# EAGLE design GPS Module_2 (EAGLE 9.6.2)
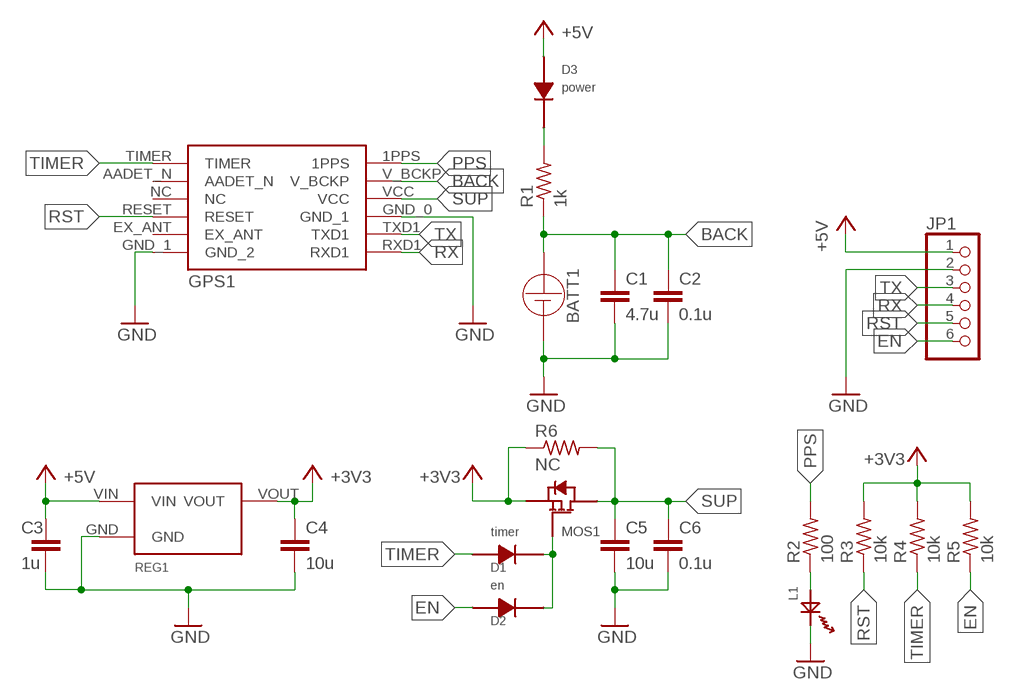
[diagram p0: schematic, sheet 1]

## Parts
BATT1  CR2032_PLATE  [CR2032_PLATE]
C1  4.7u  C-EUC0603  [C0603]
C2  0.1u  C-EUC0603  [C0603]
C3  1u  C-EUC0603  [C0603]
C4  10u  C-EUC0603  [C0603]
C5  10u  C-EUC0603  [C0603]
C6  0.1u  C-EUC0603  [C0603]
D1  timer  1W4148W  [SOD-123]
D2  en  1W4148W  [SOD-123]
D3  power  SS2040FL  [SOD-123FL]
GPS1  L80-M39  [L80]
JP1  PINHD-1X6  [1X06]
L1  OSXX1608C1A  [OSXX1608C1A]
MOS1  AO3401A  [SOT-23]
R1  1k  R-US_R0603  [R0603]
R2  100  R-US_R0603  [R0603]
R3  10k  R-US_R0603  [R0603]
R4  10k  R-US_R0603  [R0603]
R5  10k  R-US_R0603  [R0603]
R6  NC  R-US_R0603  [R0603]
REG1  AP7375  [SOT23]

## Nets
+3V3: C4.1 MOS1.S R3.2 R4.2 R5.2 R6.1 REG1.VOUT
+5V: C3.1 D3.C JP1.1 REG1.VIN
BACK: BATT1.VCC C1.1 C2.1 GPS1.V_BCKP R1.1
EN: D2.C JP1.6 R5.1
GND [gnd]: BATT1.GND C1.2 C2.2 C3.2 C4.2 C5.2 C6.2 GPS1.GND_0(GND_1) GPS1.GND_1(GND_2) JP1.2 L1.CT REG1.GND
N$1: D3.A R1.2
N$2: D1.A D2.A MOS1.G
N$3: L1.AN R2.1
PPS: GPS1.1PPS R2.2
RST: GPS1.RESET JP1.5 R3.1
RX: GPS1.RXD1 JP1.4
SUP: C5.1 C6.1 GPS1.VCC MOS1.D R6.2
TIMER: D1.C GPS1.TIMER R4.1
TX: GPS1.TXD1 JP1.3
Unconnected: GPS1.AADET_N GPS1.EX_ANT GPS1.NC

## Library data of the parts
BATT1 = CR2032:CR2032_PLATE
C1-C6 = rcl:C-EU: CAPACITOR, European symbol; SPICEPREFIX: C
D1 D2 = ChipDiodes:1W4148W
D3 = ChipDiodes:SS2040FL
GPS1 = GPS_L80:L80-M39
JP1 = pinhead:PINHD-1X6: PIN HEADER
L1 = Chip LED:OSXX1608C1A
MOS1 = AO3401A_PchMOS:AO3401A
R1-R6 = rcl:R-US_: RESISTOR, American symbol; SPICEPREFIX: R
REG1 = ChipLinearRegulator:AP7375

## Net classes
1 gnd: width 0.152 mm, clearance 0.152 mm

## Board
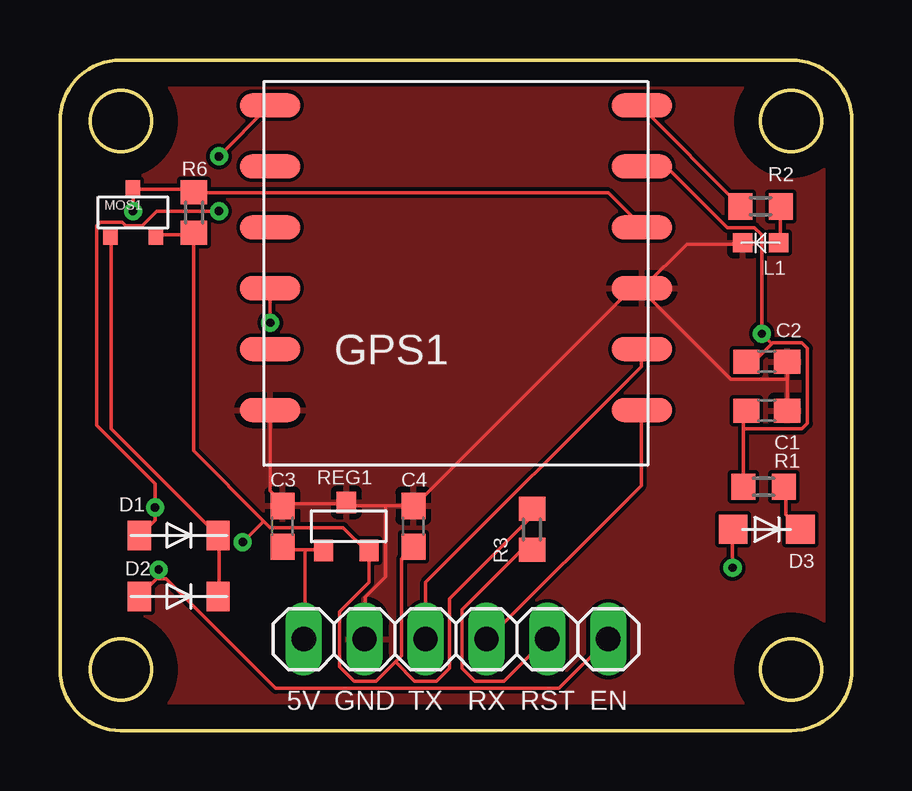
[diagram p1: board, top side]
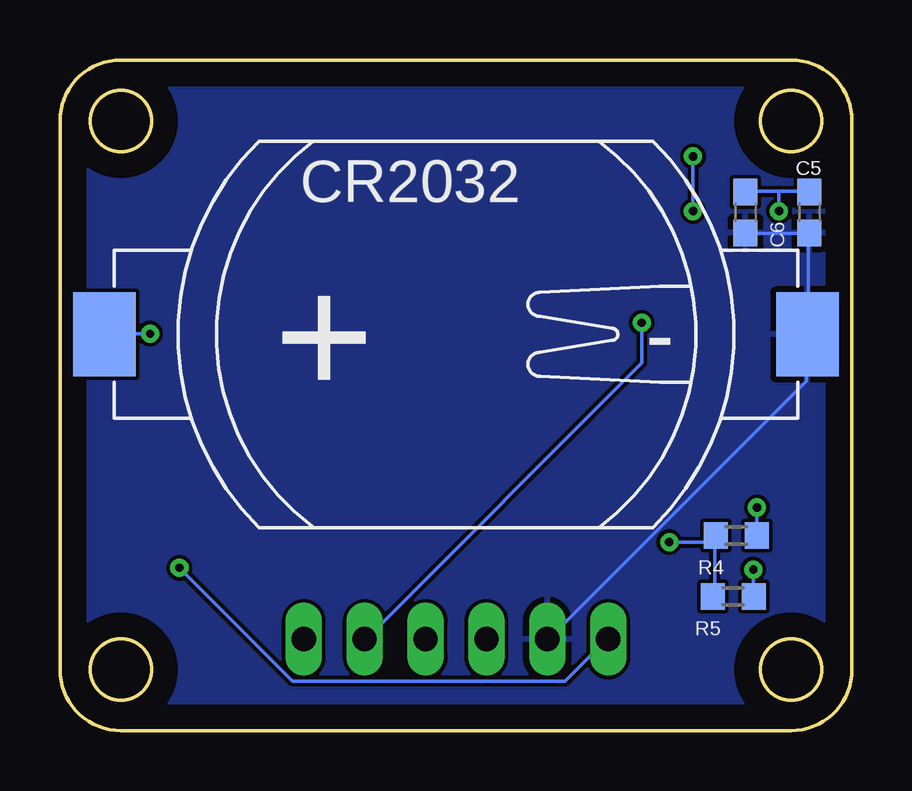
[diagram p2: board, bottom side, seen from below]

Size 33.02 x 27.94 mm. Coordinates in mm from the lower left corner, seen from the top.
Outline: 2.54,0 arc-90 0,2.54 0,25.4 arc-90 2.54,27.94 30.48,27.94 arc-90 33.02,25.4 33.02,2.54 arc-90 30.48,0 2.54,0
Outline: circle at 2.54,2.54 radius 1.27
Outline: circle at 30.48,2.54 radius 1.27
Outline: circle at 2.54,25.4 radius 1.27
Outline: circle at 30.48,25.4 radius 1.27
Copper layers (1*16): Top 0.035mm / dielectric 1.5mm / Bottom 0.035mm
Design rules "default": minimum track width 6mil, minimum drill 0.35mm, track to track 6mil, track to pad 6mil, pad to pad 6mil, via to via 6mil, smd to smd 6mil, copper to edge 40mil, drill to drill 6mil, minimum pad ring 10mil, minimum via ring 8mil, stop-mask expansion 4mil, vias tented up to drill 0mil, thermal gap 10mil

### Footprints (pad centres in the part's own frame; a part is rotated, then mirrored left to right if it is on the bottom)
CR2032_PLATE = smd 2.6 x 3.5: GND 14.65,0; VCC -14.65,0
C0603 = smd 1.1 x 1: 1 -0.85,0; 2 0.85,0
SOD-123 = smd 0.97 x 1.22: A 1.64,0; C -1.64,0
SOD-123FL = smd 1.2 x 1.2: A 1.4,0; C -1.4,0
L80 = smd 2.5 x 1: 1PPS 7.75,7; AADET_N -7.75,4.46; EX_ANT -7.75,-3.16; GND_0 -7.75,-5.7; GND_1 7.75,-0.62; NC -7.75,1.92; RESET -7.75,-0.62; RXD1 7.75,-5.7; TIMER -7.75,7; TXD1 7.75,-3.16; V_BCKP 7.75,4.46; VCC 7.75,1.92
1X06 = drill 1.016 long: 1 -6.35,0; 2 -3.81,0; 3 -1.27,0; 4 1.27,0; 5 3.81,0; 6 6.35,0
OSXX1608C1A = smd 0.8 x 0.8: AN -0.75,0; CT 0.75,0
SOT-23 = smd 0.6 x 0.7: D 0,1; G -0.95,-1; S 0.95,-1
R0603 = smd 1 x 1.1: 1 -0.85,0; 2 0.85,0
SOT23 = smd 0.8 x 0.9: GND 0,1; VIN -0.95,-1; VOUT 0.95,-1

### Placement (x,y rotation side)
BATT1  16.51,16.51 0 bottom
C1  29.46,13.34 0 top
C2  29.46,15.37 0 top
C3  9.27,8.51 90 top
C4  14.73,8.51 90 top
C5  1.78,21.59 270 bottom
C6  4.45,21.59 270 bottom
D1  4.95,8.13 0 top
D2  4.95,5.59 0 top
D3  29.46,8.38 0 top
GPS1  16.51,19.05 0 top
JP1  16.51,3.81 0 top
L1  29.21,20.32 180 top
MOS1  3.05,21.59 0 top
R1  29.34,10.16 0 top
R2  29.21,21.84 180 top
R3  19.68,8.38 90 top
R4  4.83,8.13 180 bottom
R5  4.95,5.59 180 bottom
R6  5.59,21.59 90 top
REG1  11.94,8.51 0 top

### Tracks (layer width: path | path; a pad name or v marks a point on that pad's centre or on a via)
+3V3  (via drill 0.35)
  Top 0.152: MOS1.S 4.04,20.65 5.49,20.65 5.56,20.73 R6.1 5.56,20.65 5.56,11.66 8.5,8.72 | 13.98,2.86 14.25,3.12 14.25,7.16 14.71,7.62 C4.1 | 13.98,2.86 13.18,2.06 12.27,2.06 11.66,2.67 11.66,4.95 12.88,6.17 12.88,7.47 REG1.VOUT 12.8,7.47 11.81,8.46 8.76,8.46 8.5,8.72 | 13.98,2.86 14.78,2.06 15.7,2.06 16.23,2.59 16.23,5.49 19.66,8.91 19.66,9.22 R3.2 | 8.5,8.72 v7.62,7.85
  Bottom 0.152: 5.71,7.85 5.71,5.71 5.79,5.64 R5.2 | 5.71,7.85 5.71,8.08 R4.2 5.71,7.85 | v7.62,7.85 5.71,7.85
+5V  (via drill 0.35)
  Top 0.152: 10.21,7.54 9.37,7.54 9.3,7.62 C3.1 | 10.21,7.54 10.97,7.54 REG1.VIN | v28.04,6.78 28.04,8.38 D3.C | 10.21,7.54 10.21,3.81 JP1.1
  Bottom 0.152: v28.04,6.78 23.32,2.06 11.96,2.06 10.21,3.81 JP1.1
BACK  (via drill 0.35)
  Top 0.152: 28.5,12.57 28.5,13.26 28.57,13.34 C1.1 | 28.5,12.57 28.5,10.21 R1.1 | 29.68,16.12 29.72,16.15 30.94,16.15 31.17,15.93 31.17,12.8 30.94,12.57 28.5,12.57 | 29.68,16.12 28.96,15.39 28.65,15.39 C2.1 | 29.68,16.12 v29.26,16.54 29.26,20.65 28.96,20.95 27.81,20.95 25.3,23.47 24.31,23.47 GPS1.V_BCKP
  Bottom 0.152: v29.26,16.54 31.09,16.54 BATT1.VCC
EN  (via drill 0.35)
  Top 0.152: v4.12,6.71 4.12,6.4 4.08,6.36 | 4.08,6.36 3.35,5.64 D2.C | JP1.6 20.8,1.75 8.99,1.75 4.42,6.33 4.12,6.33 4.08,6.36
  Bottom 0.152: v4.12,6.71 4.12,5.64 R5.1
GND
  Top 0.152: 30.33,14.63 30.33,15.32 C2.2 | 30.33,14.63 30.33,13.34 C1.2 | L1.CT 28.42,20.27 26.14,20.27 24.31,18.44 GPS1.GND_1 | 30.33,14.63 27.96,14.63 24.23,18.36 GPS1.GND_1 | 13.56,9.37 11.89,9.37 REG1.GND 11.89,9.45 9.37,9.45 9.3,9.37 C3.2 9.3,9.45 8.76,9.98 8.76,13.34 GPS1.GND_0 | 13.56,9.37 14.71,9.37 C4.2 14.78,9.37 23.77,18.36 24.16,18.36 GPS1.GND_1 | 13.56,9.37 13.56,6.4 12.72,5.56 12.72,3.81 JP1.2
  Bottom 0.152: C6.2 4.42,20.73 1.83,20.73 C5.2 1.83,20.65 1.83,16.54 BATT1.GND 1.91,16.46 1.91,14.55 12.65,3.81 JP1.2
  pour Bottom: -1.27,29.21 -1.27,-1.27 34.29,-1.27 34.29,29.21
  pour Top: -1.27,29.21 -1.27,-1.27 34.29,-1.27 34.29,29.21
N$1
  Top 0.152: R1.2 30.25,10.13 30.25,8.99 D3.A
N$2
  Top 0.152: MOS1.G 2.13,20.57 2.13,12.57 6.55,8.15 D1.A 6.63,8.08 6.63,5.64 D2.A
N$3
  Top 0.152: L1.AN 30.02,20.34 30.02,21.79 R2.1
PPS
  Top 0.152: R2.2 28.35,21.87 24.23,25.98 GPS1.1PPS
RST  (via drill 0.35)
  Top 0.152: R3.1 19.66,7.47 19.2,7.47 16.76,5.03 16.76,2.59 17.3,2.06 18.52,2.06 20.27,3.81 JP1.5 | v8.76,16.99 8.76,18.36 GPS1.RESET
  Bottom 0.152: v8.76,16.99 8.76,15.32 20.27,3.81 JP1.5
RX
  Top 0.152: GPS1.RXD1 24.23,13.34 24.23,10.21 17.83,3.81 JP1.4
SUP  (via drill 0.35)
  Top 0.152: 3.05,22.55 5.49,22.55 5.56,22.48 R6.2 5.64,22.4 22.86,22.4 24.23,21.03 GPS1.VCC | v3.05,21.64 3.05,22.55 | 3.05,22.55 MOS1.D
  Bottom 0.152: 3.05,22.48 4.42,22.48 C6.1 | 3.05,22.48 1.83,22.48 C5.1 | 3.05,22.48 v3.05,21.64
TIMER  (via drill 0.35)
  Top 0.152: D1.C 3.35,8.15 3.96,8.76 v3.96,9.3 3.96,10.29 1.52,12.72 1.52,21.03 1.68,21.18 2.59,21.18 2.74,21.03 3.43,21.03 4.04,21.64 v6.63,21.64 | v6.63,23.93 8.69,25.98 GPS1.TIMER
  Bottom 0.152: v3.96,9.3 3.96,8.15 R4.1 | v6.63,23.93 v6.63,21.64
TX
  Top 0.152: JP1.3 15.24,6.17 24.23,15.16 24.23,15.85 GPS1.TXD1

### Text on the board
tNames: 5V | GND | TX | RX | RST | EN